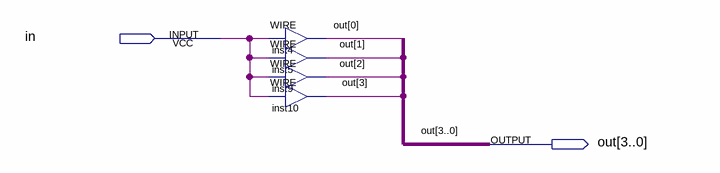
[diagram p0: schematic sheet]
// Quartus schematic extend1to4.bdf as structural Verilog: 4 symbols, 2 pins
module extend1to4 (
  input  in,
  output [3:0] out
);

  assign out[0] = in;  // WIRE inst4
  assign out[1] = in;  // WIRE inst5
  assign out[2] = in;  // WIRE inst9
  assign out[3] = in;  // WIRE inst10
endmodule
